# EasyEDA Pro project luoye-mainboard-2026-08-30.epro, board ZHUBAN
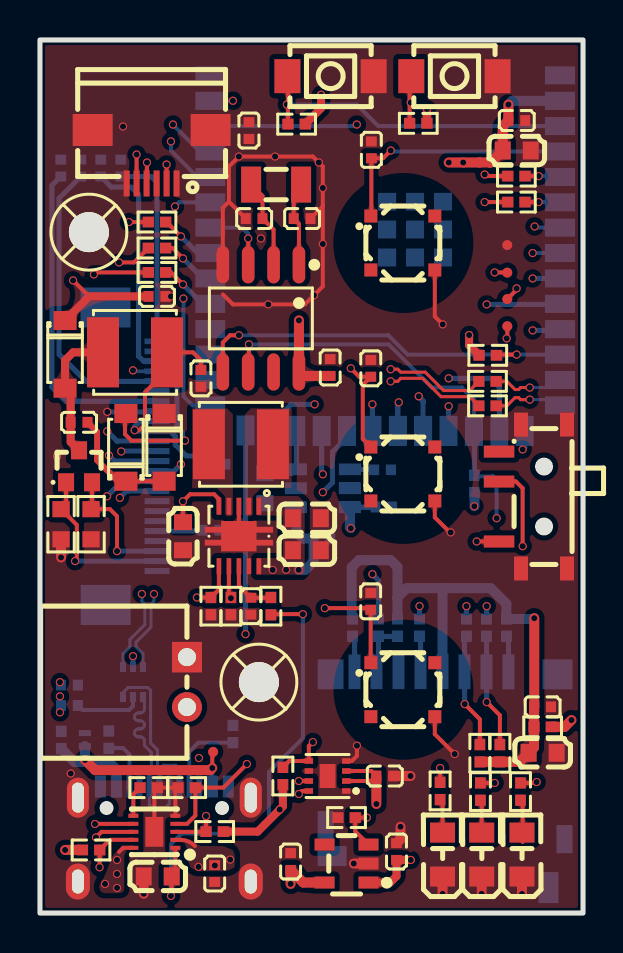
[diagram p1: board, top side]
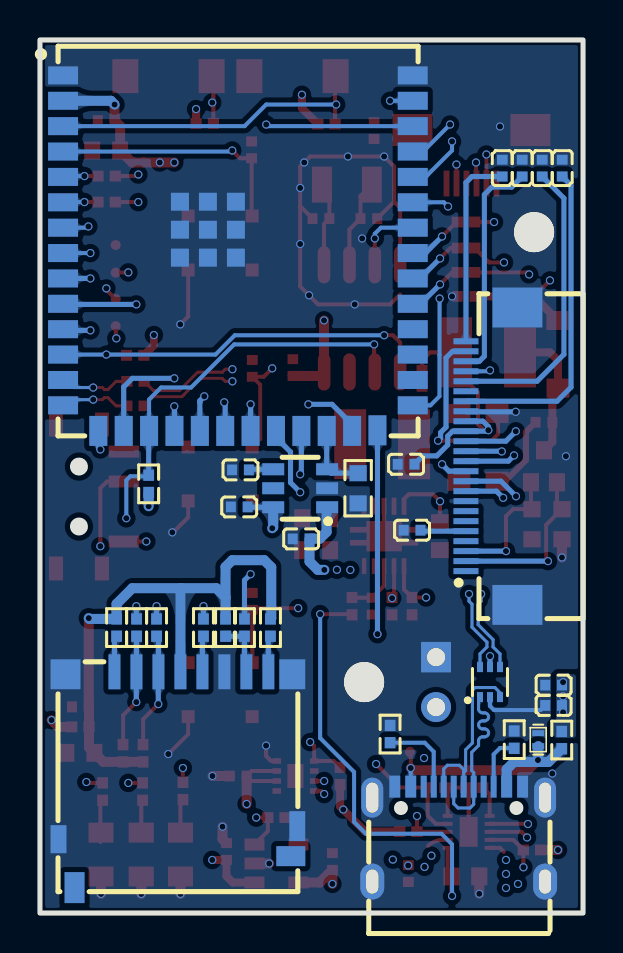
[diagram p2: board, bottom side, seen from below]

Outline 27.18 x 43.69 mm; copper layers: Top Layer, Inner1, Inner2, Inner3, Inner4, Bottom Layer. Coordinates in mm from the lower left corner of the outline.
Outline path: rectangle 0,43.69 27.18,0
Stack: Top Layer 0.035mm Outer layer thickness 1oz / Dielectric1 0.0994mm 3313 RC57% 4.2mil / Inner1 0.0152mm Inner layer thickness / Dielectric2 0.55mm 0.55mm H/H No copper / Inner2 0.0152mm Inner layer thickness / Dielectric3 0.1088mm 2116 RC54% 4.9mil / Inner3 0.0152mm Inner layer thickness / Dielectric4 0.55mm 0.55mm H/H No copper / Inner4 0.0152mm Inner layer thickness / Dielectric5 0.0994mm 3313 RC57% 4.2mil / Bottom Layer 0.035mm Outer layer thickness 1oz

## Design rules (mm)
net $1N5: DP1
net $1N6: DP1
net USB_D-: DP3
net USB_D+: DP3
net $1N397: DP2
net $1N398: DP2
spacing copperThickness1oz (default): track to track 0.102, other pairs 0.152 to 0.3
spacing copperThickness2oz: track to track 0.203, other pairs 0.152 to 0.3
spacing Plane_innerPlane: track to track 0.102, other pairs 0.152 to 0.3
spacing Copper_copperRegion: track to track 0.102, other pairs 0.152 to 0.3
track width copperThickness1oz (default): min 0.127, default 0.2, max 2.54
track width copperThickness2oz: min 0.203, default 0.254, max 2.54
differential pair differentialPair (default): width min 0.127, default 0.254, max 2.54; gap min 0.152, default 0.152
net 3.3V_MIC uses copperRegion
net AGND uses copperRegion
net $1N5 uses copperRegion
net PDM_DATA uses copperRegion
net BQ_PG_N uses copperRegion

## Placement (name value [footprint] x y rotation side)
C1  1uF  [C0402]  17.84 3.08 90 top
C2  100nF  [C0402]  10.56 15.36 270 top
C3  100nF  [C0402]  23.86 39.66 180 top
C4  1uF  [C0402]  8.86 22.46 180 bottom
C5  1uF  [C0402]  8.74 1.98 270 top
C6  100nF  [C0402]  25.16 10.32 180 top
C7  1uF  [C0402]  1.04 37.28 270 bottom
C8  1uF  [C0402]  2.04 37.28 270 bottom
C9  1uF  [C0402]  3.04 37.28 270 bottom
C10  1uF  [C0402]  10.46 39.16 90 top
C11  1uF  [C0402]  4.04 37.28 270 bottom
C12  4.7uF  [C0402]  8.06 26.76 270 top
C13  1uF  [C0402]  5.86 30.86 180 top
C14  4.7uF  [C0402]  1.96 24.56 0 top
C15  1uF  [C0402]  8.56 19.16 0 bottom
C16  10nF  [C0402]  17.14 22.17 180 bottom
C17  1uF  [C0402]  14.11 18.72 180 bottom
C18  4.7uF  [C0402]  17.2 20.32 180 bottom
C19  12pF  [C0402]  13.12 34.75 180 top
C20  12pF  [C0402]  10.72 34.75 0 top
C21  2.2uF  [C0402]  1.47 10.39 180 bottom
C22  100nF  [C0402]  1.47 11.4 180 bottom
C23  100nF  [C0402]  16.58 38.19 90 top
C24  100nF  [C0402]  16.56 27.26 90 top
C25  100nF  [C0402]  16.55 15.6 90 top
C26  100nF  [C0402]  17.26 6.86 180 top
C_RTC  100nF  [C0402]  14.52 27.3 90 top
CARD1  DM3D-SF  [TF-SMD_DM3D-SF]  20.27 6.67 0 bottom
CN_VBAT  ZX-XH2.54-2PWZ  [CONN-TH_2P-P2.50_ZX-XH2.54-2PWZ]  7.36 11.56 270 top
COUT_LDO  1uF  [C0402]  12.54 2.58 270 top
CSYS  10uF  [C0603]  5.89 1.83 0 top
CSYS1  10uF  [C0603]  13.36 18.16 180 top
CSYS2  10uF  [C0603]  13.36 19.76 180 top
CSYS3  10uF  [C0603]  25.16 8.02 180 top
CSYS4  10uF  [C0603]  7.16 18.86 270 top
CSYS5  10uF  [C0603]  23.86 38.16 180 top
D1  MBR0530  [SOD-123_L2.8-W1.8-LS3.7-RD]  1.26 27.96 270 top
D1TVS  H5VL10B  [SOD-882_L1.0-W0.6-BI]  2.24 8.68 270 bottom
D2  USBLC6-2P6-MS  [SOT-666-6_L1.6-W1.2-P0.50-LS1.6-BL]  4.66 11.56 180 bottom
D3  MBR0530  [SOD-123_L2.8-W1.8-LS3.7-RD]  4.3 23.3 90 top
D4  MBR0530  [SOD-123_L2.8-W1.8-LS3.7-RD]  6.21 23.3 270 top
FPC2  AFC01-S06FCA-00  [FPC-SMD_P0.50-6P_AFC01-S06FCA-00]  5.59 37.85 180 top
FPC3  FPC-05F-24PH20  [FPC-SMD_24P-P0.50_FPC-05F-24PH20]  4.57 22.86 90 bottom
GND  -  [Test-Point-0.5mm]  23.39 33.43 180 top
L1  2.2uH  [IND-SMD_L4.0-W4.0]  10.06 23.46 0 top
L2  47uH  [IND-SMD_L4.0-W4.0]  4.76 28.06 0 top
LED1  NCD0805R1  [LED0805-RD]  20.15 2.93 90 top
LED3_FULL  NCD0805R1  [LED0805-RD]  24.12 2.93 90 top
LED_CHG  NCD0805R1  [LED0805-RD]  22.11 2.93 90 top
Q1  SI1308EDL-VB  [SOT-323_L2.0-W1.3-P1.30-LS2.1-BR]  1.96 22.36 270 top
R1  100kΩ  [R0402]  8.56 15.36 90 top
R2  5.1kΩ  [R0402]  9.66 8.96 270 bottom
R3  5.1kΩ  [R0402]  3.44 8.68 90 bottom
R4  100kΩ  [R0402]  9.56 15.36 90 top
R5  100Ω  [R0402]  11.56 15.36 90 top
R6  100kΩ  [R0402]  15.34 4.78 0 top
R7  2.2Ω  [R0603]  2.56 19.46 90 top
R8  0Ω  [R0402]  1.06 8.66 90 bottom
R9  10kΩ  [R0402]  2.56 3.16 0 top
R10  10kΩ  [R0402]  8.74 4.08 0 top
R11  10kΩ  [R0402]  23.02 8 270 top
R12  10kΩ  [R0402]  22.02 8 270 top
R13  10kΩ  [R0402]  17.89 14.28 90 bottom
R14  10kΩ  [R0402]  15.64 14.28 90 bottom
R15  10kΩ  [R0402]  23.34 14.28 90 bottom
R16  10kΩ  [R0402]  7.34 6.28 180 top
R17  0Ω  [R0402]  22.4 26.6 0 top
R18  1MΩ  [R0603]  1.06 19.46 90 top
R19  0Ω  [R0402]  22.4 25.38 0 top
R20  10kΩ  [R0402]  5.44 6.28 180 top
R21  10kΩ  [R0402]  12.16 6.86 90 top
R22  10kΩ  [R0402]  21.74 21.48 90 bottom
R23  10kΩ  [R0402]  22.41 27.91 0 top
R24  100kΩ  [R0603]  11.26 21.26 90 bottom
R25  10kΩ  [R0402]  12.84 39.48 0 top
R26  10kΩ  [R0402]  18.93 39.52 0 top
R32  22Ω  [R0402]  23.84 36.88 180 top
R33  22Ω  [R0402]  23.84 35.58 180 top
R34  0Ω  [R0402]  5.86 34.58 180 top
R35  0Ω  [R0402]  5.86 33.28 180 top
R36  0Ω  [R0402]  5.86 32.06 180 top
R_CHG  2.2kΩ  [R0402]  22.04 6.08 270 top
R_FULL  2.2kΩ  [R0402]  24.05 6.08 270 top
R_LED  2.2kΩ  [R0402]  20.03 6.11 270 top
R_SD_PWR  0Ω  [R0402]  25.16 9.32 180 top
SCREW1  -  [M2螺丝]  2.45 34.07 0 top
SCREW2  -  [M2螺丝]  10.96 11.56 0 top
SD_CS  22Ω  [R0402]  22.34 14.28 270 bottom
SD_MISO  22Ω  [R0402]  16.94 14.28 270 bottom
SD_MOSI  22Ω  [R0402]  21.34 14.28 270 bottom
SD_SCK  22Ω  [R0402]  18.99 14.28 270 bottom
SW1  MSK12C02  [SW-TH_MSK12C02]  24.68 20.84 90 top
SW3  U34B352210  [SW-SMD_4P-L3.7-W3.7-P2.70-LS3.7]  18.16 33.53 0 top
SW4  U34B352210  [SW-SMD_4P-L3.7-W3.7-P2.70-LS3.7]  18.16 21.97 0 top
SW5  U34B352210  [SW-SMD_4P-L3.7-W3.7-P2.70-LS3.7]  18.16 11.18 0 top
SW6  HX 3x4x2-2P-1.6N TACTILE SWITCH  [KEY-SMD_L4.0-W3.0-LS4.9-1]  14.54 41.88 180 top
SW7  HX 3x4x2-2P-1.6N TACTILE SWITCH  [KEY-SMD_L4.0-W3.0-LS4.9-1]  20.74 41.88 180 top
TP1  -  [Test-Point-0.5mm]  8.66 8.06 90 top
U0RXD  -  [Test-Point-0.5mm]  23.39 32.05 180 top
U0TXD  -  [Test-Point-0.5mm]  23.39 30.72 180 top
U1  BQ25186DLHR  [WSON-10_L2.2-W2.0-P0.40-BL-EP_TI_DLH0010A]  5.72 4.06 90 top
U2  TPS63001DRCR  [VSON-10_L3.0-W3.0-P0.50-TL-EP_TPS62410DRCR]  9.96 18.86 270 top
U3  PCF8563T(UMW)  [SOP-8_L4.9-W3.9-P1.27-LS6.0-BL]  11.06 29.76 180 top
U5  TPS7A2033PDBVR  [SOT-23-5_L2.9-W1.6-P0.95-LS2.8-BR]  15.34 2.48 0 top
U6  TPS22918DBVR  [SOT-23-6_L2.9-W1.6-P0.95-LS2.8-BR]  14.16 21.26 180 bottom
U7  2.4GHz  [WIRELM-SMD_ESP32-S3-WROOM-1U]  17.27 33.02 180 bottom
U8  MAX17048G+T10  [TDFN-8_L2.0-W2.0-P0.50-BL-EP1.2]  14.39 6.86 90 top
USB2  TYPE-C 16PIN 2MD(073)  [USB-C-SMD_TYPE-C-16PIN-2MD-073]  6.22 3.95 180 bottom
VCC  -  [Test-Point-0.5mm]  23.39 29.36 90 top
X1  32.768kHz  [FC-135R_L3.2-W1.5]  11.82 36.45 0 top

## Footprints (pads in the part's own frame, mm; a bottom-side part is the same pattern mirrored in y, then rotated)
C0402
  rect 0.5x0.54 smd: 1(-0.42,0) 2(0.42,0)
C0603
  rect 0.8x0.9 smd: 1(-0.7,0) 2(0.7,0)
CONN-TH_2P-P2.50_ZX-XH2.54-2PWZ
  rect 1.524x1.5 hole 0.9: 1(-1.25,0)
  round 1.5 hole 0.9: 2(1.25,0)
FC-135R_L3.2-W1.5
  rect 1x1.8 smd: 1(-1.25,0) 2(1.25,0)
FPC-SMD_24P-P0.50_FPC-05F-24PH20
  rect 0.3x1.25 smd: 1(-5.75,1.288) 2(-5.25,1.288) 3(-4.75,1.288) 4(-4.25,1.288) 5(-3.75,1.288) 6(-3.25,1.288) 7(-2.75,1.288) 8(-2.25,1.288) 9(-1.75,1.288) 10(-1.25,1.288) 11(-0.75,1.288) 12(-0.25,1.288) 13(0.25,1.288) 14(0.75,1.288) 15(1.25,1.288) 16(1.75,1.288) 17(2.25,1.288) 18(2.75,1.288) 19(3.25,1.288) 20(3.75,1.288) 21(4.25,1.288) 22(4.75,1.288) 23(5.25,1.288) 24(5.75,1.288)
  rect 2x2.5 smd: 25(7.44,-1.288) 26(-7.44,-1.288)
FPC-SMD_P0.50-6P_AFC01-S06FCA-00
  rect 0.3x1.3 smd: 1(-1.248,1.339) 2(-0.748,1.339) 3(-0.248,1.339) 4(0.252,1.339) 5(0.752,1.339) 6(1.252,1.339)
  rect 2x1.6 smd: 7(-2.95,-1.339) 8(2.95,-1.339)
IND-SMD_L4.0-W4.0
  rect 1.6x3.5 smd: 1(-1.6,0) 2(1.6,0)
KEY-SMD_L4.0-W3.0-LS4.9-1
  rect 1.3x1.7 smd: 1(-2.159,0) 2(2.159,0)
LED0805-RD
  rect 1x1.25 smd: 1(-1.1,0) 2(1.1,0)
M2螺丝
  round 2 hole 2: 1(0,0)
R0402
  rect 0.566x0.54 smd: 1(-0.433,0) 2(0.433,0)
R0603
  rect 0.806x0.864 smd: 1(-0.753,0) 2(0.753,0)
SOD-123_L2.8-W1.8-LS3.7-RD
  rect 0.95x1.15 smd: 1(-1.692,0) 2(1.692,0)
SOD-882_L1.0-W0.6-BI
  rect 0.3x0.6 smd: 1(-0.325,0) 2(0.325,0)
SOP-8_L4.9-W3.9-P1.27-LS6.0-BL
  oval 0.63x1.865 smd: 1(-1.905,-2.683) 2(-0.635,-2.683) 3(0.635,-2.683) 4(1.905,-2.683) 5(1.905,2.683) 6(0.635,2.683) 7(-0.635,2.683) 8(-1.905,2.683)
SOT-23-5_L2.9-W1.6-P0.95-LS2.8-BR
  rect 1x0.6 smd: 1(1.1,-0.95) 2(1.1,0) 3(1.1,0.95) 4(-1.1,0.95) 5(-1.1,-0.95)
SOT-23-6_L2.9-W1.6-P0.95-LS2.8-BR
  rect 1.1x0.6 smd: 1(1.35,-0.95) 2(1.35,0) 3(1.35,0.95) 4(-1.35,0.95) 5(-1.35,0) 6(-1.35,-0.95)
SOT-323_L2.0-W1.3-P1.30-LS2.1-BR
  rect 0.9x0.8 smd: 1(0.8,-0.65) 2(0.8,0.65) 3(-0.8,0)
SOT-666-6_L1.6-W1.2-P0.50-LS1.6-BL
  rect 0.3x0.5 smd: 1(-0.5,-0.75) 2(0,-0.75) 3(0.5,-0.75) 4(0.5,0.75) 5(0,0.75) 6(-0.5,0.75)
SW-SMD_4P-L3.7-W3.7-P2.70-LS3.7
  rect 0.65x0.65 smd: 1(-1.6,1.35) 2(1.6,1.35) 3(-1.6,-1.35) 4(1.6,-1.35)
SW-TH_MSK12C02
  rect 0.6x1.524 smd: 1(-2.25,1.7) 2(0.75,1.7) 3(2.25,1.7)
  rect 1.2x0.7 smd: 4(-3.6,0.6) 4(-3.6,-1.7) 4(3.6,0.6) 4(3.6,-1.7)
TDFN-8_L2.0-W2.0-P0.50-BL-EP1.2
  rect 0.28x0.425 smd: 1(-0.75,-0.938) 2(-0.25,-0.938) 3(0.25,-0.938) 4(0.75,-0.938) 5(0.75,0.938) 6(0.25,0.938) 7(-0.25,0.938) 8(-0.75,0.938)
  rect 1.2x0.8 smd: 9(0,0)
Test-Point-0.5mm
  round 0.5 smd: 1(0,0)
TF-SMD_DM3D-SF
  rect 0.6x1.75 smd: 1(3.175,-5.4) 2(2.075,-5.4) 3(0.975,-5.4) 4(-0.125,-5.4) 5(-1.225,-5.4) 6(-2.325,-5.4) 7(-3.425,-5.4) 8(-4.525,-5.4)
  rect 1.45x1 smd: 9(-5.65,3.825)
  rect 1x1.55 smd: 10(5.175,5.4)
  rect 0.8x1.5 smd: 11(-5.975,2.325)
  rect 0.8x1.4 smd: 12(5.975,2.975)
  rect 1.5x1.5 smd: 13(5.625,-5.275)
  rect 1.3x1.5 smd: 14(-5.725,-5.275)
USB-C-SMD_TYPE-C-16PIN-2MD-073
  oval 1.2x1.8 hole 0.6x1.2: 13(-4.325,-2.375) 14(4.325,-2.375)
  oval 1.1x2 hole 0.6x1.5: 13(-4.325,1.825) 14(4.325,1.825)
  rect 0.55x1.1 smd: A1B12(-3.2,2.375) A4B9(-2.4,2.375) B1A12(3.2,2.375) B4A9(2.4,2.375)
  rect 0.3x1.1 smd: A5(-1.25,2.375) A6(-0.25,2.375) A7(0.25,2.375) A8(1.25,2.375) B5(1.75,2.375) B6(0.75,2.375) B7(-0.75,2.375) B8(-1.75,2.375)
VSON-10_L3.0-W3.0-P0.50-TL-EP_TPS62410DRCR
  rect 0.85x0.24 smd: 1(-1.5,1) 2(-1.5,0.5) 3(-1.5,0) 4(-1.5,-0.5) 5(-1.5,-1)
  rect 0.8x0.23 smd: 6(1.5,-1) 7(1.5,-0.5) 8(1.5,0) 9(1.5,0.5) 10(1.5,1)
  custom 1.52x3.42 smd: 11(0,-0.005)
WIRELM-SMD_ESP32-S3-WROOM-1U
  rect 1.5x0.9 smd: 1(-8.75,8.895) 2(-8.75,7.625) 3(-8.75,6.355) 4(-8.75,5.085) 5(-8.75,3.815) 6(-8.75,2.545) 7(-8.75,1.275) 8(-8.75,0.005) 9(-8.75,-1.265) 10(-8.75,-2.535) 11(-8.75,-3.805) 12(-8.75,-5.075) 13(-8.75,-6.345) 14(-8.75,-7.615) 27(8.75,-7.615) 28(8.75,-6.345) 29(8.75,-5.075) 30(8.75,-3.805) 31(8.75,-2.535) 32(8.75,-1.265) 33(8.75,0.005) 34(8.75,1.275) 35(8.75,2.545) 36(8.75,3.815) 37(8.75,5.085) 38(8.75,6.355) 39(8.75,7.625) 40(8.75,8.895)
  rect 0.9x1.5 smd: 15(-6.985,-8.895) 16(-5.715,-8.895) 17(-4.445,-8.895) 18(-3.175,-8.895) 19(-1.905,-8.895) 20(-0.635,-8.895) 21(0.635,-8.895) 22(1.905,-8.895) 23(3.175,-8.895) 24(4.445,-8.895) 25(5.715,-8.895) 26(6.985,-8.865)
  rect 0.9x0.9 smd: 41(-2.9,-0.225) 41(-2.9,1.175) 41(-2.9,2.575) 41(-1.5,-0.225) 41(-1.5,1.175) 41(-1.5,2.575) 41(-0.1,-0.225) 41(-0.1,1.175) 41(-0.1,2.575)
WSON-10_L2.2-W2.0-P0.40-BL-EP_TI_DLH0010A
  rect 0.2x0.5 smd: 1(-0.8,-1.05) 2(-0.4,-1.05) 3(0,-1.05) 4(0.4,-1.05) 5(0.8,-1.05) 6(0.8,1.05) 7(0.4,1.05) 8(0,1.05) 9(-0.4,1.05) 10(-0.8,1.05)
  rect 1.5x0.9 smd: 11(0,0)

## Nets
As in the schematic, except:
VBAT+: C5.1 C26.2 C_RTC.1 CN_VBAT.2 U1.2 U3.8 U8.2 U8.3

Pads without a net: CARD1 9 10; FPC3 1 4 6 7 19; SW1 3; SW3 2 3; SW4 2 3; SW5 2 3; U3 7; U5 4; U6 5; U7 28 29 30; USB2 A8 B8

## Via types
v1: diameter 0.409, hole 0.305, Top Layer to Bottom Layer, 149 vias

## Routing (per net, layer and track width the routed paths; a pad name or vN(x,y) marks a point on that pad's centre or on a via; arc(x,y) is an arc through that point)
3.3V_MIC: length 49
  Top Layer w0.2: FPC2.5 v1(4.84,37.96)
  Top Layer w0.5: U5.5 13.17,1.53 COUT_LDO.2 v1(12.54,1.46)
  Inner4 w0.5: v1(4.84,37.96) 4.75,37.87 4.75,37.3 5.36,36.7 5.36,28.76 11.06,23.06 14.26,23.06 16.46,20.86 16.46,18.36 15.26,17.16 15.26,7.16 12.54,4.44 v1(12.54,1.46)
AGND: length 51.1
  Top Layer w0.2: 9.46,35.59 9.15,35.29 U3.4 ; 9.46,35.59 C20.1 ; 9.46,35.59 9.46,37.36 v1(9.96,37.86) v1(11.77,37.86) 13.66,37.86 v1(13.95,37.56) 14.16,37.36 v1(14.16,36.28) 14.16,35.37 ; U2.11 9.96,18.86 U2.3 ; U1.5 6.77,6.14 R16.2 R20.1 5.72,6.13 U1.11 ; 15.33,7.61 15.61,7.61 15.86,7.86 v1(15.86,8.38) ; v1(20.16,29.46) 19.76,29.85 SW3.4 ; v1(20.76,7.96) 19.76,8.95 SW5.4 ; C19.1 14.16,35.37 ; 14.16,35.37 v1(14.16,33.48) 14.16,31.36 v1(13.71,30.91) 13.26,30.46 v1(11.43,30.46) 9.66,30.46 9.16,30.96 ; 20.56,19 19.76,19.8 SW4.4
  Top Layer w0.5: C1.2 18.04,3.7 v1(18.04,4.32) ; LED_CHG.1 v1(22.11,0.96) ; LED1.1 v1(20.15,0.96) ; 1.06,18.66 v1(1.06,17.79) ; U5.2 v1(15.7,2.48) ; LED3_FULL.1 v1(24.12,0.96) ; 5.19,1.83 v1(5.19,0.96) ; C26.1 v1(18.55,6.86)
  Bottom Layer w0.2: D2.2 4.66,10.36 4.46,10.16 2.13,10.16 C21.1
  Bottom Layer w0.254: v1(3.37,25.08) 5.83,25.08 FPC3.17
  vias: v1(0.86,22.86) v1(1.54,6.98) v1(4.16,39.36) v1(6.56,30.86) v1(11.06,33.76) v1(20.56,19.05)
VBAT+: length 51.1
  Top Layer w0.2: 15.33,6.61 16.59,6.61 C26.2 16.58,7.11 U8.3 ; U1.2 7.01,3.66 arc(7.42,3.58) 7.76,3.36
  Top Layer w0.5: v1(12.96,29.66) U3.8 13.16,26.88 C_RTC.1 ; C26.2 v1(16.84,5.46)
  Inner4 w0.5: v1(12.96,29.66) 14.36,28.26 14.36,24.96 17.86,21.46 17.86,16.16 16.84,15.14 v1(16.84,5.46) 17.16,5.14 17.16,2.06 15.66,0.56 12.26,0.56 11.76,1.06 11.76,2.96 11.46,3.26 9.66,3.26 9.52,3.11 v1(9.52,2.67)
  vias: v1(7.59,2.87) v1(7.93,2.31) v1(8.75,2.38)
VCC: length 26.7
  Top Layer w0.2: VCC.1 23.39,28.79 v1(23.36,28.76)
  Top Layer w0.4: v1(18.56,2.66) C1.1 17.84,1.84 17.53,1.53 U5.1 ; v1(21.48,28.92) 21.48,28.41 R23.1 ; R10.2 10.9,4.08 v1(12,5.18) 12.16,5.33 R21.1 ; 13.27,39.48 14.07,40.28 v1(14.07,40.95) ; 19.36,39.52 v1(19.36,40.23)
  Top Layer w0.5: v1(23.44,40.46) C3.2 23.16,39.38 CSYS5.2 22.56,37.56 22.51,37.56 22.51,37.56 22,37.56 22,37.56 v1(21.18,37.56) v1(20.46,37.56) ; R9.1 v1(1.26,3.16) ; v1(26.6,9.66) 26.26,9.32 R_SD_PWR.1
  Bottom Layer w0.5: 12.83,20.06 12.83,19.07 13.17,18.73 13.63,18.73 ; v1(12.95,17.17) 13.27,17.17 13.69,17.59 C17.2 ; U7.2 23.63,40.64 v1(23.44,40.46) ; R22.1 v1(21.74,20.36)
  vias: v1(11.65,17.17) v1(12.32,17.18)
VCC_EPD: length 28.5
  Top Layer w0.2: v1(4.74,24.16) 4.96,24.16 5.26,24.46 5.26,26.06 6.36,27.16 L2.2 7.66,28.06 8.06,27.66 C12.1
  Inner4 w0.5: v1(4.74,24.16) 4.93,24.36 8.36,24.36 13.46,19.26 v1(15.56,19.26)
  Bottom Layer w0.254: C18.2 16.77,20.31 U6.6 ; C4.2 8.02,22.88 7.32,22.88 6.77,23.42 6.77,23.87 6.53,24.11 FPC3.15 4.79,24.11 v1(4.74,24.16) 4.74,24.34 5.01,24.61 FPC3.16
  Bottom Layer w0.5: v1(15.56,19.26) 15.51,19.31 U6.6
VCC_SD: length 29.6
  Top Layer w0.5: v1(24.74,14.76) C6.2 24.72,10.3 R_SD_PWR.2 24.72,8.28 CSYS3.2 24,7.56 22.02,7.56
  Bottom Layer w0.5: CARD1.4 20.15,16.23 20.12,16.26 ; v1(24.74,14.76) 24.7,14.72 R15.2 23.34,15.47 22.56,16.26 20.12,16.26 ; 17.89,15.79 18.36,16.26 20.12,16.26 ; 17.89,15.79 17.89,17.32 17.56,17.66 15.96,17.66 15.6,17.3 15.6,14.76 R14.2 ; 17.89,15.79 R13.2
BACK_KEY: length 45.8
  Top Layer w0.2: v1(14.26,15.26) 16.47,15.26 C25.1 16.55,12.54 16.56,12.53
  Inner3 w0.2: v1(9.66,40.64) 9.64,40.66 7.76,40.66 7.31,40.21 7.31,35.26 5.12,33.07 5.12,32.22 4.13,31.23 4.13,24.11 4.83,23.41 4.83,20.46 4.31,19.95 4.31,15.69 5.55,14.46 13.46,14.46 v1(14.26,15.26)
  Bottom Layer w0.2: U7.39 v1(9.66,40.64)
BAT_ALRT: length 41.7
  Top Layer w0.2: 12.16,7.29 12.47,7.61 13.45,7.61 13.45,8.35 v1(13.66,8.56)
  Inner3 w0.2: v1(6.76,35.36) 6.76,35.14 4.76,33.14 4.76,32.28 3.83,31.35 3.83,23.98 4.52,23.29 4.52,20.59 3.4,19.47 3.4,14.91 5.36,12.96 5.36,9.36 6.16,8.56 v1(13.66,8.56)
  Bottom Layer w0.2: v1(6.76,35.36) 6.96,35.56 U7.35
BOOT: length 28.5
  Top Layer w0.2: R26.1 18.5,41.79 SW7.2
  Inner3 w0.2: v1(7.18,30.75) 7.61,31.18 7.61,38.51 9.01,39.91 17.91,39.91 v1(18.56,40.56)
  Bottom Layer w0.2: v1(7.18,30.75) 7.18,27.93 7.19,27.92 7.19,25.86 7.64,25.4 U7.27
BQ_CE_N: length 40.3
  Top Layer w0.2: v1(10.36,7.46) 9.18,6.28 R16.1 7.78,4.88 7.36,4.46 U1.4 ; R36.2 2.8,32.06 v1(2.7,31.96)
  Inner3 w0.2: v1(10.36,7.46) 9.56,6.66 5.36,6.66 2.51,9.5 2.51,31.77 v1(2.7,31.96)
BQ_INT_N: length 37.5
  Top Layer w0.2: U1.9 3.56,3.66 3.55,3.65 3.49,3.65 R9.2 2.99,2.3 v1(2.98,2.29) ; v1(3.96,32.56) 4.7,32.56 R35.2
  Inner3 w0.2: v1(2.98,2.29) 2.98,3.32 4.08,4.42 4.08,7.5 2.21,9.37 2.21,32.11 2.65,32.56 v1(3.96,32.56)
BQ_PG_N: length 37.9
  Top Layer w0.2: v1(8.31,4.86) R10.1 8.3,4.06 U1.3 ; R34.2 v1(4.45,34.58)
  Inner2 w0.2: v1(7.96,7.76) 7.96,5.21 v1(8.31,4.86)
  Inner3 w0.2: v1(7.96,7.76) 4.68,7.76 2.82,9.62 2.82,30.77 4.45,32.41 v1(4.45,34.58)
CHG_LED: length 31.3
  Top Layer w0.2: 22.04,6.51 v1(22.76,6.51)
  Inner2 w0.2: v1(22.76,6.51) 23.19,6.07 25.06,6.07 25.24,6.26 25.26,6.26 26.1,7.1 26.1,23.01 25.35,23.76 25.35,31.06 v1(24.66,31.75)
  Bottom Layer w0.254: 26.02,31.75 v1(24.66,31.75)
EPD_BUSY: length 16.2
  Inner2 w0.2: v1(4,20.78) 4.58,21.36 13.86,21.36 v1(14.16,21.06)
  Bottom Layer w0.254: v1(14.16,21.06) 14.64,21.54 14.64,23.07 15.53,23.96 U7.22 ; v1(4,20.78) 4.33,21.11 FPC3.9
EPD_CS: length 21.9
  Inner2 w0.2: v1(3.45,22.9) 3.45,23.17 3.87,23.58 5.38,23.58 5.89,24.09 19.19,24.09 v1(20.46,25.36)
  Bottom Layer w0.254: v1(3.45,22.9) 3.74,22.61 5.86,22.61 FPC3.12 ; v1(20.46,25.36) 20.45,25.35 U7.18
EPD_DC: length 27
  Inner2 w0.2: v1(24.66,29.16) 25,28.81 25,23.35 24.1,22.46 v1(7.06,22.46)
  Bottom Layer w0.254: v1(24.66,29.16) 25.96,29.16 26.02,29.21 ; FPC3.11 6.71,22.11 v1(7.06,22.46)
EPD_MOSI: length 25.8
  Inner2 w0.2: v1(3.36,24.11) 4.26,25 18.7,25 19.1,25.4 19.14,25.4 19.41,25.67 19.41,25.71 v1(20.46,26.76)
  Bottom Layer w0.254: v1(3.36,24.11) 3.86,23.61 FPC3.14 ; v1(20.46,26.76) 22.56,26.76 22.99,26.32 U7.16
EPD_POWER_EN: length 3.6
  Bottom Layer w0.254: U7.24 12.83,22.23 U6.3 12.61,22.01 R24.2
EPD_RST: length 16.3
  Inner2 w0.2: v1(14.16,21.96) 4.46,21.96 v1(3.36,20.86)
  Bottom Layer w0.254: v1(14.16,21.96) 14.1,22.01 U7.23 ; FPC3.10 4.11,21.61 v1(3.36,20.86)
EPD_SCLK: length 23
  Inner2 w0.2: v1(4.07,23.1) 4.22,22.94 23.9,22.94 v1(24.16,23.2)
  Bottom Layer w0.254: FPC3.13 4.1,23.11 4.09,23.1 v1(4.07,23.1) ; v1(24.16,23.2) 24.26,23.3 24.26,24.12
FULL_LED: length 31.9
  Top Layer w0.2: v1(24.86,6.56) 24.81,6.51 24.05,6.51
  Inner2 w0.2: v1(10.29,13.96) 23.06,13.96 23.56,13.46 23.56,7.96 24.86,6.66 v1(24.86,6.56)
  Bottom Layer w0.254: U7.26 v1(10.29,13.96)
GDR: length 8.5
  Top Layer w0.2: 1.16,20.21 1.31,20.36 Q1.1 ; v1(1.76,17.61) 1.84,17.7 1.84,19.42 R18.2
  Bottom Layer w0.254: FPC3.2 v1(1.76,17.61)
I2C_SCL: length 58.5
  Top Layer w0.2: v1(10.46,28.46) 10.46,27.11 U3.6 ; U1.8 3.08,4.06 v1(2.8,3.78) ; 13.45,6.61 v1(12.96,6.61)
  Inner2 w0.2: v1(12.96,6.61) 12.5,6.15 12.5,4.43 11.7,3.63 2.96,3.63 v1(2.8,3.78)
  Inner3 w0.2: v1(22.86,19.76) 23.05,19.56 23.05,7.98 21.33,6.26 13.3,6.26 v1(12.96,6.61)
  Bottom Layer w0.2: U7.17 21.72,25.69 21.11,26.3 19.61,26.3 17.46,28.46 v1(10.46,28.46) ; v1(22.86,19.76) 22.86,21.66 22.66,21.86 21.79,21.86 21.74,21.91
  Bottom Layer w0.254: U7.17 21.74,24.1 21.74,21.91
I2C_SDA: length 67.6
  Top Layer w0.2: U8.8 13.11,6.11 v1(12.96,5.96) ; v1(2.76,4.46) 2.76,4.46 U1.7 ; R23.2 22.88,27.94 v1(23.86,27.94) ; v1(9.96,28.91) 9.51,28.91 9.15,28.55 U3.5
  Inner2 w0.2: v1(2.76,4.46) 2.35,4.05 2.35,3.59 2.61,3.33 11.83,3.33 12.8,4.3 12.8,5.8 v1(12.96,5.96)
  Inner3 w0.2: v1(12.96,5.96) 21.46,5.96 23.36,7.86 23.36,27.44 v1(23.86,27.94)
  Bottom Layer w0.2: v1(9.96,28.91) 17.43,28.91 18.39,27.94 v1(23.86,27.94) U7.12
MARK_KEY: length 24.7
  Top Layer w0.2: 16.56,23.32 16.16,23.73 16.16,26.44 C24.1 15.98,26.84 v1(15.56,27.26)
  Inner3 w0.2: v1(15.86,39.46) 15.56,39.16 v1(15.56,27.26)
  Bottom Layer w0.2: v1(15.86,39.46) 15.77,39.37 U7.38
MIC_LDO_EN: length 42.3
  Top Layer w0.2: v1(16.36,4.78) R6.2 15.78,4.09 U5.3
  Inner3 w0.2: v1(16.36,4.78) 24.38,4.78 26.08,6.48 26.08,33.04 v1(24.76,34.36)
  Bottom Layer w0.2: U7.7 24.82,34.29 v1(24.76,34.36)
PDM_CLK: length 18.3
  Top Layer w0.2: v1(22.26,36.96) 22.34,36.88 R32.2 ; FPC2.2 v1(6.34,37.46)
  Inner2 w0.2: v1(6.34,37.46) 6.69,37.1 22.11,37.1 v1(22.26,36.96)
PDM_DATA: length 20.3
  Top Layer w0.2: v1(5.36,37.56) 5.36,36.53 FPC2.4 ; R33.2 v1(22.26,35.58)
  Inner2 w0.2: v1(22.26,35.58) 22.26,36.26 21.71,36.8 6.11,36.8 v1(5.36,37.56)
PREVGH: length 14.2
  Top Layer w0.2: v1(1.66,31.66) 2.46,30.86
  Top Layer w0.4: D1.1 2.46,30.86 C13.2
  Inner2 w0.2: v1(1.66,31.66) 1.66,27.76 2.26,27.16 v1(4.66,27.16)
  Bottom Layer w0.2: v1(4.66,27.16) 4.7,27.11 FPC3.21
PREVGL: length 9.6
  Top Layer w0.2: D3.2 4.26,24.95 4.26,23.96 4.58,23.64 v1(7.26,23.64)
  Bottom Layer w0.254: FPC3.23 6.53,28.11 6.86,27.78 6.86,24.31 7.13,24.04 7.13,23.76 v1(7.26,23.64)
PWR_MODE: length 34.2
  Top Layer w0.2: v1(9.56,15.76) 9.46,15.86 U2.7
  Inner3 w0.2: v1(9.56,15.76) 9.56,25.46 10.11,26.01 17.96,26.01 18.36,26.41 18.36,32.06 19.32,33.02 v1(24.66,33.02)
  Bottom Layer w0.2: U7.8 v1(24.66,33.02)
REC_KEY: length 12.5
  Top Layer w0.2: v1(17.56,38.16) 17.17,37.77 C23.1 16.58,34.9 16.56,34.88
  Bottom Layer w0.2: v1(17.56,38.16) 17.61,38.1 U7.4
REC_LED: length 25.4
  Top Layer w0.2: R_LED.1 v1(20.03,7.26)
  Inner3 w0.2: v1(13.74,25.45) 15.46,25.45 16.15,24.76 16.15,11.13 v1(20.03,7.26)
  Bottom Layer w0.254: v1(13.74,25.45) 12.56,25.45 11.56,24.45 U7.25
RESE: length 6.5
  Top Layer w0.2: Q1.2 2.61,20.26 2.66,20.21 3.5,20.21 3.86,19.86 v1(3.86,18.11)
  Bottom Layer w0.254: FPC3.3 v1(3.86,18.11)
RESET: length 16.5
  Top Layer w0.2: R25.1 12.41,41.85 SW6.2
  Bottom Layer w0.2: U7.3 16.94,39.37 15.86,40.46 v1(12.36,40.46)
RTC_INT: length 3.6
  Top Layer w0.2: U3.3 v1(10.42,33.76)
  Bottom Layer w0.2: U7.34 10.12,34.29 10.42,33.99 v1(10.42,33.76)
SD_CS: length 19.4
  Inner3 w0.2: v1(22.36,15.36) v1(22.36,30.46)
  Bottom Layer w0.254: v1(22.36,15.36) 22.36,14.73 SD_CS.1 ; v1(22.36,30.46) 25.99,30.46 U7.10
SD_MISO: length 12.2
  Inner3 w0.2: v1(16.64,25.46) v1(16.64,16.96)
  Bottom Layer w0.254: U7.21 v1(16.64,25.46) ; v1(16.64,16.96) 16.94,16.65 SD_MISO.1
SD_MOSI: length 14.7
  Inner3 w0.2: v1(21.34,15.36) 20.05,15.36 19.35,16.06 19.35,25.38 18.91,25.81 v1(18.96,25.86)
  Bottom Layer w0.254: SD_MOSI.1 v1(21.34,15.36) ; U7.19 19.18,25.55 19.17,25.56 19.17,25.64 v1(18.96,25.86)
SD_SCK: length 13
  Inner3 w0.2: v1(18.99,15.36) 18.99,24.92 18.36,25.56 v1(17.96,25.56)
  Bottom Layer w0.254: U7.20 17.91,25.51 v1(17.96,25.56) ; SD_SCK.1 v1(18.99,15.36)
SYS_PWR: length 54.7
  Top Layer w0.2: R5.1 11.59,14.96 v1(13.16,14.96) ; SW1.1 v1(21.86,18.59) ; U1.1 6.77,2.01 CSYS.2 6.59,0.89 v1(6.56,0.86) ; CSYS4.1 v1(7.16,20.6) 7.51,20.96 8.71,20.96 8.96,20.71 U2.5
  Inner2 w0.2: v1(21.86,18.59) 9.17,18.59 v1(7.16,20.6) 7.16,15.36 7.56,14.96 v1(13.16,14.96)
  Bottom Layer w0.2: v1(13.16,14.96) 13.16,8.76 11.46,7.06 11.46,4.56 10.87,3.97 7.09,3.97 6.56,3.44 v1(6.56,0.86)
USB_5V_PROT: length 6
  Top Layer w0.2: 3.96,3.06 4.16,3.26 U1.10
  Inner2 w0.4: v1(1,11.55) 4.15,11.55 4.66,12.06 v1(4.66,12.86)
  Bottom Layer w0.254: D2.5 v1(4.66,12.86)
  vias: v1(1,10.84) v1(1,10.04) v1(3.26,1.46) v1(3.86,2.66) v1(3.86,1.96) v1(3.86,1.26)
USB_D+: length 31.9
  Top Layer w0.154: v1(17.55,26.61) 17.91,26.61 18.06,26.76 19.16,26.76 20.07,25.84 21.5,25.84 R19.1
  Inner3 w0.154: v1(17.55,26.61) 17.19,26.61 17.04,26.76 16.89,26.76 16.49,26.36 8.64,26.36 arc(8.55,26.32) 8.51,26.23 arc(8.47,26.14) 8.38,26.1 8.24,26.1 arc(8.15,26.14) 8.11,26.23 arc(8.07,26.32) 7.98,26.36 7.84,26.36 arc(7.75,26.32) 7.71,26.23 arc(7.67,26.14) 7.58,26.1 7.44,26.1 arc(7.35,26.14) 7.31,26.23 arc(7.27,26.32) 7.18,26.36 6.56,26.36 5.56,25.36 5.56,16.47 5.71,16.32 v1(5.71,15.96)
  Bottom Layer w0.154: D2.6 5.16,12.97 4.81,13.32 4.81,13.56 5.56,14.3 5.56,15.46 5.71,15.61 v1(5.71,15.96)
USB_D-: length 31.8
  Top Layer w0.154: R17.1 21.5,26.15 20.2,26.15 19.28,27.06 18.06,27.06 17.91,27.21 v1(17.55,27.21)
  Inner3 w0.154: v1(5.1,15.96) 5.1,16.32 5.25,16.47 5.25,25.48 6.43,26.66 16.36,26.66 16.76,27.06 17.04,27.06 17.19,27.21 v1(17.55,27.21)
  Bottom Layer w0.154: D2.4 4.16,12.97 4.5,13.32 4.5,13.68 5.25,14.43 5.25,15.46 5.1,15.61 v1(5.1,15.96)
VCOM: length 9.9
  Bottom Layer w0.254: C11.2 5.56,36.86 5.86,36.55 FPC3.24
$1N2: length 13.2
  Top Layer w0.2: v1(8.62,7.26) 8.62,8.02 TP1.1
  Top Layer w0.5: v1(2.26,7.66) 2.76,7.15 8.52,7.15 v1(8.62,7.26)
  Bottom Layer w0.2: USB2.A4B9 v1(8.62,7.26)
  Bottom Layer w0.5: USB2.B4A9 3.82,7.19 3.46,7.56 1.73,7.56 R8.1 ; D1TVS.2 2.24,7.56
$1N5: length 8.9
  Bottom Layer w0.153: D2.1 5.23,10.73 5.23,10.22 arc(5.17,10.07) 5.03,10.02 4.93,10.02 arc(4.73,9.82) 4.93,9.62 5.03,9.62 arc(5.23,9.42) 5.03,9.22 4.93,9.22 arc(4.73,9.02) 4.93,8.82 5.03,8.82 arc(5.17,8.76) 5.23,8.62 5.23,8.38 5.57,8.04 5.57,7.13 5.47,7.03 USB2.B6
  Bottom Layer w0.154: USB2.B6 5.47,5.44 5.66,5.26 6.26,5.26 6.47,5.47 USB2.A6
$1N6: length 9
  Bottom Layer w0.154: 5.97,7.03 5.88,7.13 5.88,8.17 5.53,8.51 5.53,11.15 5.4,11.28 4.41,11.28 4.16,11.03 D2.3 ; 5.97,7.03 5.97,7.18 6.19,7.39 6.79,7.39 6.97,7.21 USB2.B7 ; 5.97,7.03 USB2.A7
$1N18: length 4.1
  Bottom Layer w0.2: 7.47,6.32 7.47,8.07 7.92,8.52 R2.2
$1N43: length 24
  Top Layer w0.2: v1(7.86,15.79) 8.56,15.79 8.96,16.19 U2.6 ; SW1.2 23.82,21.59 24.16,21.26 v1(24.16,18.36)
  Inner2 w0.2: v1(24.16,18.36) 23.56,17.76 9.82,17.76 v1(7.86,15.79)
$1N49: length 2.8
  Top Layer w0.2: 11.56,15.79 11.54,15.78 C2.1 9.96,16.38 U2.8
$1N121: length 5.7
  Top Layer w0.2: R11.1 23.02,9.9 v1(22.36,10.56)
  Bottom Layer w0.254: v1(22.36,10.56) 22.36,12.06 CARD1.2 22.35,13.84 SD_CS.2
$1N122: length 5.8
  Top Layer w0.2: v1(21.26,10.46) 22.02,9.7 R12.1
  Bottom Layer w0.254: SD_MOSI.2 21.25,13.76 CARD1.3 21.26,12.06 v1(21.26,10.46)
$1N123: length 1.8
  Bottom Layer w0.254: SD_SCK.2 19.05,13.8 CARD1.5
$1N125: length 1.8
  Bottom Layer w0.254: R15.1 23.45,13.74 CARD1.1
$1N127: length 2.8
  Bottom Layer w0.254: CARD1.7 16.94,12.17 SD_MISO.2 R13.1
$1N184: length 16.3
  Bottom Layer w0.254: FPC3.18 1.3,25.61 0.6,26.31 0.6,36.41 C7.2
$1N185: length 14.8
  Bottom Layer w0.254: FPC3.20 2.3,26.61 0.96,27.96 0.96,35.77 C8.2
$1N188: length 11.4
  Bottom Layer w0.254: FPC3.22 5.19,27.61 4.94,27.86 4.94,35.95 4.56,36.33 3.57,36.33 C9.2
$1N199: length 5.9
  Top Layer w0.2: D3.1 D4.2
  Top Layer w0.3: C14.2 2.86,24.07 2.86,22.65 3.9,21.61 D3.1
$1N200: length 6.9
  Top Layer w0.4: Q1.3 1.54,23.58 C14.1 1.54,25.98 D1.2 1.26,27.66 1.66,28.06 L2.1
$1N212: length 2.3
  Bottom Layer w0.254: C15.1 8.09,19.11 FPC3.5
$1N218: length 1.2
  Bottom Layer w0.254: C16.2 16.69,22.21 U6.4
$1N241: length 1.8
  Bottom Layer w0.254: R14.1 15.75,13.74 CARD1.8
$1N256: length 4.5
  Top Layer w0.2: 11.69,32.44 11.69,34.2 C20.2 11.14,35.88 X1.1
$1N257: length 4.3
  Top Layer w0.2: X1.2 12.7,36.08 C19.2 12.96,34.49 U3.1
$1N288: length 1.7
  Top Layer w0.2: LED1.2 20.15,5.55 R_LED.2
$1N294: length 1.6
  Top Layer w0.2: R_CHG.2 22.11,5.58 LED_CHG.2
$1N297: length 2.1
  Top Layer w0.2: R_FULL.2 24.16,5.53 24.16,3.56
$1N309: length 1.6
  Top Layer w0.2: R20.2 4.67,5.94 U1.6
$1N348: length 26.5
  Top Layer w0.2: U0RXD.1 23.38,32.06 v1(22.76,32.06)
  Inner2 w0.2: v1(22.76,32.06) 23.16,32.46 23.16,37.86 22.4,38.61 v1(6.56,38.61)
  Bottom Layer w0.2: 8.52,36.83 7.88,36.83 6.56,38.16 v1(6.56,38.61)
$1N355: length 27.5
  Top Layer w0.2: v1(23.86,31.26) 23.86,31.19 U0TXD.1
  Inner2 w0.2: v1(6.66,39.46) 7.2,38.91 22.52,38.91 23.46,37.98 23.46,31.65 v1(23.86,31.26)
  Bottom Layer w0.2: U7.37 8.01,38.1 v1(6.66,39.46)
$1N383: length 1.8
  Top Layer w0.2: R32.1 v1(24.96,36.88)
  Bottom Layer w0.2: v1(24.96,36.88) 25.98,36.88 26.02,36.83
$1N385: length 1.8
  Top Layer w0.2: R33.1 v1(24.96,35.58)
  Bottom Layer w0.2: U7.6 26.01,35.58 v1(24.96,35.58)
$1N388: length 2.9
  Top Layer w0.2: v1(7.06,33.86) 6.34,34.58 R34.1
  Bottom Layer w0.254: U7.33 7.89,33.02 v1(7.06,33.86)
$1N390: length 2.9
  Top Layer w0.2: R35.1 6.64,33.28 v1(7.16,32.76)
  Bottom Layer w0.254: 8.52,31.75 8.16,31.75 v1(7.16,32.76)
$1N392: length 2.9
  Top Layer w0.2: R36.1 6.56,32.06 v1(7.16,31.46)
  Bottom Layer w0.254: v1(7.16,31.46) 8.13,30.48 U7.31
$1N397: length 3.6
  Top Layer w0.154: v1(24.51,26.29) 24.06,26.29 23.96,26.2 23.77,26.2 23.37,26.6 R17.2
  Bottom Layer w0.154: v1(24.51,26.29) 25.47,26.29 25.85,26.67 U7.13
$1N398: length 3.5
  Top Layer w0.154: v1(24.51,25.69) 24.06,25.69 23.96,25.79 23.77,25.79 23.37,25.38 R19.2
  Bottom Layer w0.154: v1(24.51,25.69) 25.57,25.69 25.85,25.4 U7.14
$1N405: length 2.8
  Bottom Layer w0.2: 4.47,6.32 4.47,7.94 4.16,8.26 3.46,8.26 R3.1

## Copper pours and planes (outline as drawn; the poured copper is in the pictures)
AGND on Top Layer: 0,43.69 27.18,43.69 27.18,0 0,0
AGND on Bottom Layer: 0,43.69 27.18,43.69 27.18,0 0,0
AGND on Inner1: 0,43.69 27.18,43.69 27.18,0 0,0
AGND on Inner2: 0,43.69 27.18,43.69 27.18,0 0,0
AGND on Inner3: 0,43.69 27.18,43.69 27.18,0 0,0
VBAT+ on Top Layer: 7.22,3.54 9.75,3.54 9.75,2.1 7.22,2.1
VBAT+ on Inner4: 5.76,11.36 9.75,11.36 9.75,2.1 5.76,2.1
VCC on Top Layer: 10.81,20.86 13.25,20.86 13.25,16.93 10.81,16.93
VCC on Inner4: 0,43.69 27.18,43.69 27.18,0 0,0
USB_5V_PROT on Top Layer: 2.95,3.27 4.35,3.27 4.35,0.99 2.95,0.99
USB_5V_PROT on Bottom Layer: 0.35,11.95 1.55,11.95 1.55,8.76 0.35,8.76
USB_5V_PROT on Inner4: 0.8,11.9 4.96,11.9 4.96,0.96 0.8,0.96
$1N50 on Top Layer: 7.61,25.26 9.66,25.26 9.66,19.86 7.61,19.86
$1N51 on Top Layer: 10.26,25.26 12.6,25.26 12.6,19.86 10.26,19.86

Small or netless copper shapes (teardrops, artwork), in the pictures only: 252 on Top Layer, 182 on Bottom Layer, 38 on Inner2, 30 on Inner3, 1 on Inner4
